# Altium project Arduino Nano.PrjPcb
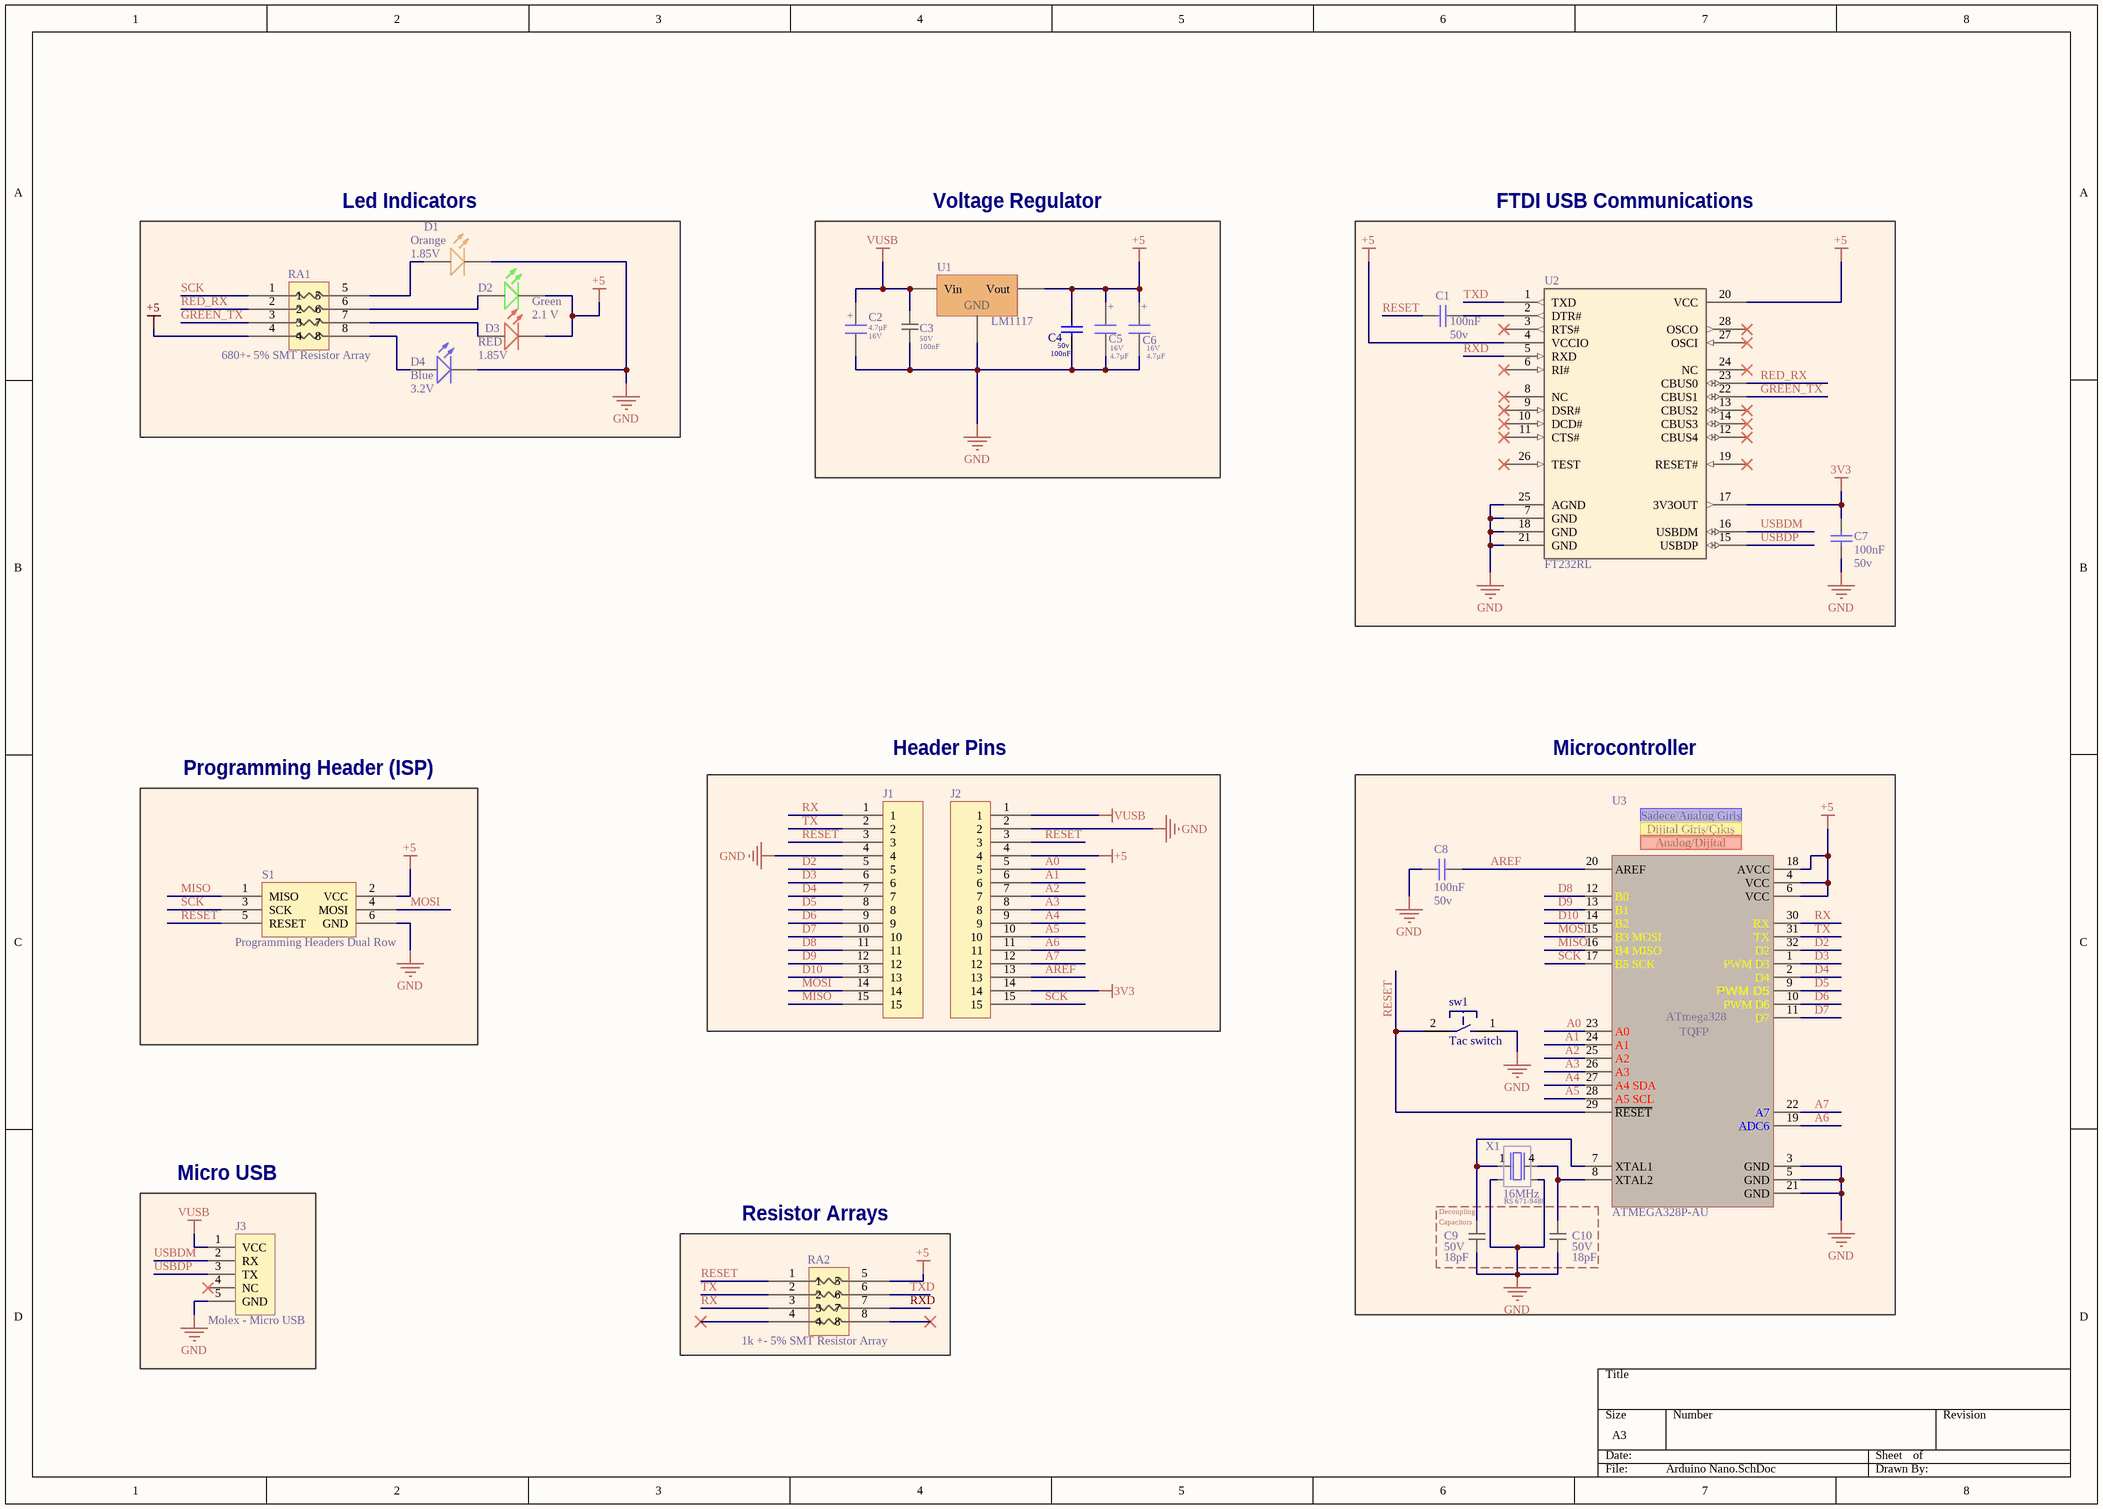
[diagram p0: Arduino Nano.SchDoc]
1 sheet, 25 parts. Net scope: global (net labels, ports and power ports of the same name join across sheets).
Board file: Arduino Nano.PcbDoc

## Sheet Arduino Nano.SchDoc
size A3

### Parts
C1  Volte: 50v  [MY_0805]  (hidden comment: 100nF)
C2  value 4.7µF  Voltage: 16V  [CASE A - 3216X18]  (hidden comment: Capacitor SMT Tantalum)
C3  Voltage: 50V  Capacitance: 100nF  [CAPCP2012X09N]  (hidden comment: 100nF Ceramic Multilayer Capacitor_1)
C4  Volte: 50v  [MY_0805]  (hidden comment: 100nF)
C5  value 4.7µF  Voltage: 16V  [CASE A - 3216X18]  (hidden comment: Capacitor SMT Tantalum)
C6  value 4.7µF  Voltage: 16V  [CASE A - 3216X18]  (hidden comment: Capacitor SMT Tantalum)
C7  Volte: 50v  [MY_0805]  (hidden comment: 100nF)
C8  Volte: 50v  [MY_0805]  (hidden comment: 100nF)
C9  Voltage: 50V  Capacitance: 18pF  [CAPCP2012X09N]  (hidden comment: C0805C180J5GACTU)
C10  Voltage: 50V  Capacitance: 18pF  [CAPCP2012X09N]  (hidden comment: C0805C180J5GACTU)
D1  Color: Orange  Forward Voltage: 1.85V  [LED1913X12NYEL/ORANGE]  (hidden comment: Kingbright Orange LED, 200 mcd 120 ° 0805)
D2  Color: Green  Forward Voltage: 2.1 V  [LED1913X12NGREEN]  (hidden comment: Kingbright Green LED, 70 mcd 120 ° 0805)
D3  Color: RED  Forward Voltage: 1.85V  [LED1913X12NRED]  (hidden comment: Kingbright Red LED, 100 mcd 120 ° 0805)
D4  Color: Blue  Forward Voltage: 3.2V  [LED1913X12NBLUE]  (hidden comment: Kingbright Blue LED, 60 mcd 120 ° 0805)
J1  connector;str header;single row;.1 cont centers;.095 tail;gold or gtx;36 contact  [Header]  (value not drawn)
J2  connector;str header;single row;.1 cont centers;.095 tail;gold or gtx;36 contact  [Header]  (value not drawn)
J3  Molex - Micro USB  [MOLEX_1050170001]
RA1  680+- 5% SMT Resistor Array  [1206 RA]
RA2  1k +- 5% SMT Resistor Array  [1206 RA]
S1  Programming Headers Dual Row  [ISP HEADER]
sw1  Tac switch  [MY_PB-SMD]
U1  LM1117  [MY_SOT223]
U2  FT232RL  [SSOP-28-FT232RL]
U3  ATMEGA328P-AU  [TQFP80P900X900X120-32N]
X1  value 16MHz  RS: RS 671-9488  [Aker S5C Crystal]  (hidden comment: Aker 16MHz Crystal SMT)

### Nets
3V3: C7.2 J2.14 U2.17(3V3OUT)
+5: C4.2 C5.1 C6.1 D2.2(K) D3.2(K) J2.4 RA1.4 RA2.5 S1.2(VCC) U1.2(Vout) U2.4(VCCIO) U2.20(VCC) U3.4(VCC) U3.6(VCC) U3.18(AVCC)
GND: C2.2 C3.1 C4.1 C5.2 C6.2 C7.1 C8.1 C9.1 C10.1 D1.2(K) D4.2(K) J1.4 J2.2 J3.5(GND) S1.6(GND) sw1.1 U1.1(GND) U2.7(GND) U2.18(GND) U2.21(GND) U2.25(AGND) U3.3(GND) U3.5(GND) U3.21(GND) X1.2(Gnd) X1.3(Gnd)
VUSB: C2.1 C3.2 J2.1 J3.1(VCC) U1.3(Vin)
A0: J2.5 U3.23(A0)
A1: J2.6 U3.24(A1)
A2: J2.7 U3.25(A2)
A3: J2.8 U3.26(A3)
A4: J2.9 U3.27(A4_SDA)
A5: J2.10 U3.28(A5_SCL)
A6: J2.11 U3.19(ADC6)
A7: J2.12 U3.22(A7)
AREF: C8.2 J2.13 U3.20(AREF)
D2: J1.5 U3.32(D2)
D3: J1.6 U3.1(PWM_D3)
D4: J1.7 U3.2(D4)
D5: J1.8 U3.9(PWM_D5)
D6: J1.9 U3.10(PWM_D6)
D7: J1.10 U3.11(D7)
D8: J1.11 U3.12(B0)
D9: J1.12 U3.13(B1)
D10: J1.13 U3.14(B2)
GREEN_TX: RA1.3 U2.22(CBUS1)
MISO: J1.15 S1.1(MISO) U3.16(B4_MISO)
MOSI: J1.14 S1.4(MOSI) U3.15(B3_MOSI)
RED_RX: RA1.2 U2.23(CBUS0)
RESET: C1.1 J1.3 J2.3 RA2.1 S1.5(RESET) sw1.2 U3.29(~{RESET})
RX: J1.1 RA2.3 U3.30(RX)
RXD: RA2.7 U2.5(RXD)
SCK: J2.15 RA1.1 S1.3(SCK) U3.17(B5_SCK)
TX: J1.2 RA2.2 U3.31(TX)
TXD: RA2.6 U2.1(TXD)
USBDM: J3.2(RX) U2.16(USBDM)
USBDP: J3.3(TX) U2.15(USBDP)
NetC1_2: C1.2 U2.2(DTR#)
NetC9_2: C9.2 U3.7(XTAL1) X1.1
NetC10_2: C10.2 U3.8(XTAL2) X1.4
NetD1_1: D1.1(A) RA1.5
NetD2_1: D2.1(A) RA1.6
NetD3_1: D3.1(A) RA1.7
NetD4_1: D4.1(A) RA1.8

Not connected (* = marked no-connect by the designer): J3 4(NC)*; RA2 4* 8*; U2 3(RTS#)* 6(RI#)* 8(NC)* 9(DSR#)* 10(DCD#)* 11(CTS#)* 12(CBUS4)* 13(CBUS2)* 14(CBUS3)* 19(RESET#)* 24(NC)* 26(TEST)* 27(OSCI)* 28(OSCO)*

### Notes on the sheet
- (near D1) Led Indicators
- Voltage Regulator
- FTDI USB Communications
- Programming Header (ISP)
- Header Pins
- Microcontroller
- Micro USB
- Resistor Arrays
- (near C9) Decoupling
- (near C9) Capacitors
- (in symbol 4.7µF Tant RS 496-3545) +
- (in symbol AtmelMicrocontroller) Sadece Analog Giriş; Dijital Giriş/Çıkış; Analog/Dijital; ATmega328; TQFP

### Library data of the parts
C1 C4 C7 C8 = Cap ceramic: None polar capacitor; ASiD Part Number: C-AS; Value: 100nF
C2 C5 C6 = 4.7µF Tant RS 496-3545: Capacitor,tantalum,SMT,16V,4.7uF,10%,A-case; Part Originator: H Theron; RS Stock Nr.: 496-3545; Tolerance: 10%; Package: 3216-18; Publisher: DPSS; LatestRevisionDate: 28-April-2010; ComponentLink1Description: Supplier Website; ComponentLink1URL: http://za.rs-online.com/web/search/searchBrowseAction.html?method=getProduct&R=4963545; ComponentLink2Description: RS Data sheet; ComponentLink2URL: http://docs-europe.origin.electrocomponents.com/webdocs/04ed/0900766b804ed4cc.pdf
C3 = 100nF Ceramic Multilayer Capacitor_1: AVX 0805 Standard 100nF Ceramic Multilayer Capacitor, 50 V dc X7R Dielectric ±10% SMD; Creator: Ritesh Kanjee; Date Created: 18 February 2015; Package: 0805; Manufacturer: AVX; RS Stock No.: 464-6688; Datasheet URL: http://za.rs-online.com/web/p/ceramic-multilayer-capacitors/4646688/
C9 C10 = 18pF Ceramic Multilayer Capacitor, 50 V dc C0G Dielectric ±5% SMD: Manufacturer: Kemet; Creator: Ayberk Özkan; Date Created: 18 February 2015; Package: 0805; RS Stock No.: 648-0935; Datasheet URL: http://za.rs-online.com/web/p/ceramic-multilayer-capacitors/6480935/?searchTerm=C0805C180J5GACTU&relevancy-data=636F3D3226696E3D4931384E4B6E6F776E41734D504E266C753D656E266D6D3D6D61746368616C6C7061727469616C26706D3D5E5B5C707B4C7D5C707B4E647D2D2C2F255C2E5D2B2426706F3D313326736E3D592673743D4D414E5F504152545F4E554D4245522677633D424F5448267573743D4330383035433138304A35474143545526
D1 = Kingbright Orange LED, 200 mcd 120 ° 0805: Manufacturer Part No.: KP-2012SEC; Creator: Ayberk Özkan; Date Created: 18 February 2015; Manufacturer: KingBright; RS Stock No.: 466-3790; Datasheet URL: http://za.rs-online.com/web/p/visible-leds/4663790/
D2 = Kingbright Green LED, 70 mcd 120 ° 0805: Manufacturer Part No.: KP-2012MGC; Creator: Ayberk Özkan; Date Created: 18 February 2015; Manufacturer: KingBright; RS Stock No.: 466-3778; Datasheet URL: http://za.rs-online.com/web/p/visible-leds/4663778/
D3 = Kingbright Red LED, 100 mcd 120 ° 0805: Manufacturer Part No.: KP-2012SRC-PRV; Creator: Ayberk Özkan; Date Created: 18 February 2015; Manufacturer: KingBright; RS Stock No.: 466-3813; Datasheet URL: http://za.rs-online.com/web/p/visible-leds/4663813/
D4 = Kingbright Blue LED, 60 mcd 120 ° 0805: Manufacturer Part No.: KP-2012PBC-A; Creator: Ayberk Özkan; Date Created: 18 February 2015; Manufacturer: KingBright; RS Stock No.: 466-3784; Datasheet URL: http://za.rs-online.com/web/p/visible-leds/4663784/
J1 J2 = Single row; PCB headers: Manufacturer: FCI; Manufacturer Part No.: 68000-236HLF; Current Rating: 3Amps Continuous; Created By: Ayberk Özkan; Date Created: 1 March 2015; RS Stock No.: 2509565626
J3 = Molex - Micro USB Connector 30V, 1.8A: Molex USB Connector, SMT, Socket B, Solder, Right Angle; ComponentLink1Description: rsdelivers; ComponentLink1URL: https://mt.rsdelivers.com/product/molex/105017-0001/molex-usb-connector-smt-socket-b-solder-right/8486764; ComponentLink2Description: datasheet; ComponentLink2URL: https://docs.rs-online.com/4d62/0900766b813885f7.pdf
RA1 = 680 +- 5% SMT Resistor Array 4 Res 1206: Manufacturer: Bourns; Manufacturer Part No.: CAY16-681J4LF; Wattage: 0.25W; Creator: Ayberk Özkan; RS Stock No.: 552-5579; Date Created: 25 February 2015
RA2 = 1k +- 5% SMT Resistor Array: 1k +- 5% SMT Resistor Array 4 Res; Manufacturer: Bourns; Manufacturer Part No.: CAY16-102J4LF; Wattage: 0.25W; Creator: Ayberk Özkan; RS Stock No.: 552-5579; Date Created: 25 February 2015
S1 = Programming ISP, Programming Headers Dual Row
sw1 = Tac switch_1: small tac switch; ASiD Part Number: Tac switch-AS
U1 = LM1117: Low Drop Voltage Reg; ASiD Part Number: LM1117-AS
U2 = FT232RL: USB Bridge, USB to UART USB 2.0 UART Interface 28-SSOP; ComponentLink1Description: SnapEda; ComponentLink1URL: https://www.snapeda.com/parts/FT232RL/FTDI,%20Future/view-part/?ref=search&t=ft232rl; ComponentLink3Description: UltraLibrarian; ComponentLink3URL: https://app.ultralibrarian.com/details/e192f762-2577-11e9-ab3a-0a3560a4cccc/FTDI-Future-Technology-Devices-International-Ltd/FT232RL?open=backlink&exports=AltiumDesigner&exports=AltiumPCADV15; ComponentLink4Description: Datasheet; ComponentLink4URL: https://www.ftdichip.com/Support/Documents/DataSheets/ICs/DS_FT232R.pdf
U3 = AtmelMicrocontroller: ATmega48A/PA/88A/PA/168A/PA/328/P; ComponentLink1Description: Datasheet; ComponentLink1URL: https://docs.rs-online.com/5775/0900766b80db4deb.pdf; ComponentLink2Description: za.rs-online; ComponentLink2URL: https://za.rs-online.com/web/p/microcontrollers/6963092/?searchTerm=6963092&relevancy-data=636F3D3126696E3D4931384E525353746F636B4E756D6265724D504E266C753D656E266D6D3D6D61746368616C6C26706D3D5E5C647B367D247C5E5C647B377D247C5E5C647B31307D2426706F3D313426736E3D592673743D52535F53544F434B5F4E554D4245522677633D4E4F4E45267573743D3639363330393226; Created by: Ayberk; Tarih: 11.12.2020
X1 = Aker  C5S-16.000-12-3030-X: Aker S5C SMT Crystal; Load Capacitance: 12pF; Frequency Stability: +/-30ppm; Creator: Ayberk Özkan; Manufacturer: Aker; Manufacturer Part #: C5S-16.000-12-3030-X; Supplier: RS; RS Stock Nr.: 671-9488; HelpURL: http://za.rs-online.com/web/p/crystal-units/6719488/; Package: 3.2x5mm SMD